# Altium schematic sheet Э3_2.SchDoc: =title_line_1 + title_line_2
size 594 x 420 mm; SheetNumber: 2; SheetTotal: 2
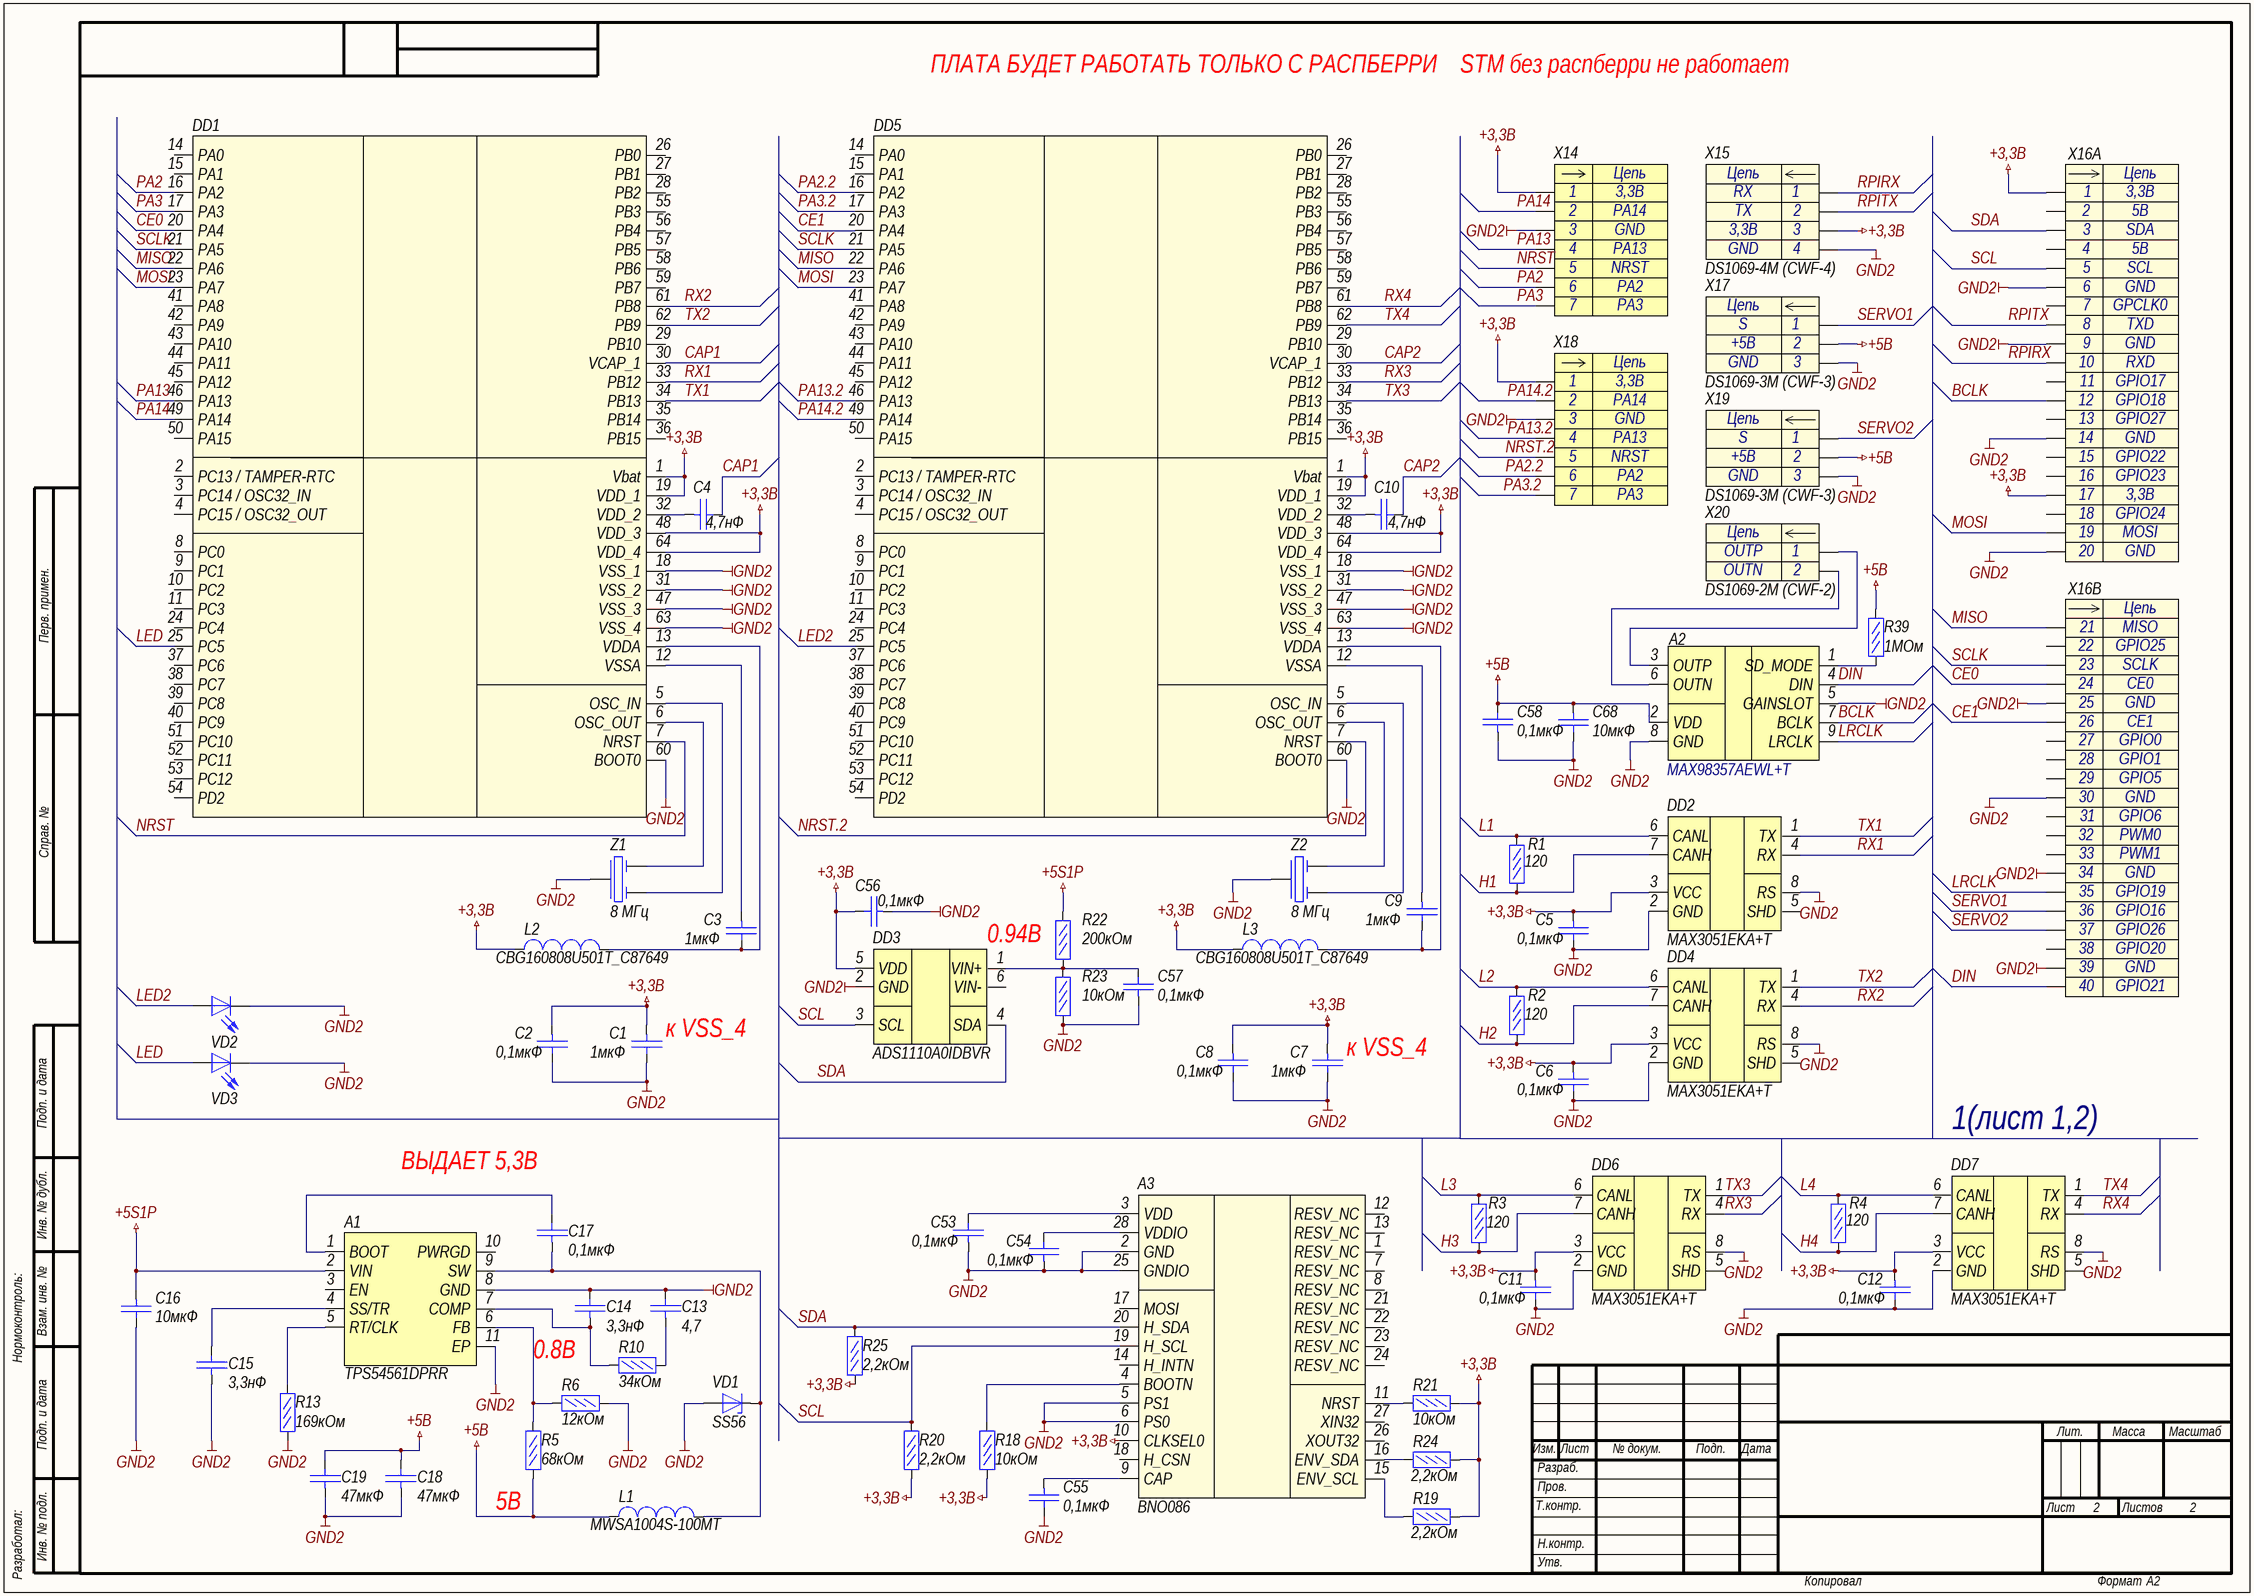
[diagram p0: Э3_2.SchDoc]

## Parts
A1  TPS54561DPRR
A2  MAX98357AEWL+T  [SO-8]
A3  BNO086  [TQFP44]
C1  1мкФ  [C0603]
C2  0,1мкФ  [C0603]
C3  1мкФ  [C0603]
C4  4,7нФ  [C0603]
C5  0,1мкФ  [C0603]
C6  0,1мкФ  [C0603]
C7  1мкФ  [C0603]
C8  0,1мкФ  [C0603]
C9  1мкФ  [C0603]
C10  4,7нФ  [C0603]
C11  0,1мкФ  [C0603]
C12  0,1мкФ  [C0603]
C13  4,7  [C0603]
C14  3,3нФ  [C0603]
C15  3,3нФ  [C0603]
C16  10мкФ  [C0603]
C17  0,1мкФ  [C0603]
C18  47мкФ  [C0603]
C19  47мкФ  [C0603]
C53  0,1мкФ  [C0603]
C54  0,1мкФ  [C0603]
C55  0,1мкФ  [C0603]
C56  0,1мкФ  [C0603]
C57  0,1мкФ  [C0603]
C58  0,1мкФ  [C0603]
C68  10мкФ  [C0603]
DD1  STM32F446RET6  [LQFP48]  (value not drawn)
DD2  MAX3051EKA+T  [SO-8]
DD3  ADS1110A0IDBVR  [SO-8]
DD4  MAX3051EKA+T  [SO-8]
DD5  STM32F446RET6  [LQFP48]  (value not drawn)
DD6  MAX3051EKA+T  [SO-8]
DD7  MAX3051EKA+T  [SO-8]
L1  MWSA1004S-100MT  [L0603]
L2  CBG160808U501T_C87649  [INDUCTION-12.2x12.2]
L3  CBG160808U501T_C87649  [INDUCTION-12.2x12.2]
R1  120  [R0603]
R2  120  [R0603]
R3  120  [R0603]
R4  120  [R0603]
R5  68кОм  [R0603]
R6  12кОм  [R0603]
R10  34кОм  [R0603]
R13  169кОм  [R0603]
R18  10кОм  [R0603]
R19  2,2кОм  [R0603]
R20  2,2кОм  [R0603]
R21  10кОм  [R0603]
R22  200кОм  [R0603]
R23  10кОм  [R0603]
R24  2,2кОм  [R0603]
R25  2,2кОм  [R0603]
R39  1МОм  [R0603]
VD1  SS56
VD2  (no value)  [LED_0603]
VD3  (no value)  [LED_0603]
X14  (no value)  [pls-2,54-7-tht-v]
X15  DS1069-4M (CWF-4)  [CWF-4]
X16  PLS-6 (DS1021-1x6)  [PLS-6]  (value not drawn)  (parts A,B of 2)
X17  DS1069-3M (CWF-3)  [CWF-2]
X18  (no value)  [pls-2,54-7-tht-v]
X19  DS1069-3M (CWF-3)  [CWF-2]
X20  DS1069-2M (CWF-2)  [CWF-2]
Z1  8 MГц  [QSMD3.2x2.5]
Z2  8 MГц  [QSMD3.2x2.5]

## Nets
+3,3В: A3.10(CLKSEL0) C1.2 C2.2 C5.2 C6.2 C7.2 C8.2 C11.2 C12.2 C56.1 DD1.1(Vbat) DD1.19(VDD_1) DD1.48(VDD_3) DD1.64(VDD_4) DD2.3(VCC) DD3.5(VDD) DD4.3(VCC) DD5.1(Vbat) DD5.19(VDD_1) DD5.48(VDD_3) DD5.64(VDD_4) DD6.3(VCC) DD7.3(VCC) L2.1 L3.1 R18.1 R19.1 R20.2 R21.2 R24.2 R25.2 X14.1 X15.3 X16.1 X16.17 X18.1
+5S1P: A1.2(VIN) C16.2 R22.2
+5В: A2.2(VDD) C18.1 C19.1 C58.1 C68.2 L1.1 R5.2 R39.1 X17.2 X19.2
GND2: A1.8(GND) A1.11(EP) A2.5(GAINSLOT) A2.8(GND) A3.2(GND) A3.5(PS1) A3.6(PS0) A3.25(GNDIO) C1.1 C2.1 C5.1 C6.1 C7.1 C8.1 C11.1 C12.1 C13.1 C14.1 C15.2 C16.1 C18.2 C19.2 C53.2 C54.2 C55.1 C56.2 C57.2 C58.2 C68.1 DD1.18(VSS_1) DD1.31(VSS_2) DD1.47(VSS_3) DD1.60(BOOT0) DD1.63(VSS_4) DD2.2(GND) DD2.8(RS) DD3.2(GND) DD4.2(GND) DD4.8(RS) DD5.18(VSS_1) DD5.31(VSS_2) DD5.47(VSS_3) DD5.60(BOOT0) DD5.63(VSS_4) DD6.2(GND) DD6.8(RS) DD7.2(GND) DD7.8(RS) R6.2 R13.2 R23.1 VD1.2(A) VD2.1(K) VD3.1(K) X14.3 X15.4 X16.6 X16.9 X16.14 X16.20 X16.25 X16.30 X16.34 X16.39 X17.3 X18.3 X19.3 Z1.2 Z2.2
BCLK: A2.7(BCLK) X16.12
CAP1: C4.1 DD1.30(VCAP_1)
CAP2: C10.1 DD5.30(VCAP_1)
CE0: DD1.20(PA4) X16.24
CE1: DD5.20(PA4) X16.26
DIN: A2.4(DIN) X16.40
H1: DD2.7(CANH) R1.1
H2: DD4.7(CANH) R2.1
H3: DD6.7(CANH) R3.1
H4: DD7.7(CANH) R4.1
L1: DD2.6(CANL) R1.2
L2: DD4.6(CANL) R2.2
L3: DD6.6(CANL) R3.2
L4: DD7.6(CANL) R4.2
LED: DD1.25(PC5) VD3.2(A)
LED2: DD5.25(PC5) VD2.2(A)
LRCLK: A2.9(LRCLK) X16.35
MISO: DD1.22(PA6) DD5.22(PA6) X16.21
MOSI: DD1.23(PA7) DD5.23(PA7) X16.19
NRST: DD1.7(NRST) X14.5
NRST.2: DD5.7(NRST) X18.5
PA2: DD1.16(PA2) X14.6
PA2.2: DD5.16(PA2) X18.6
PA3: DD1.17(PA3) X14.7
PA3.2: DD5.17(PA3) X18.7
PA13: DD1.46(PA13) X14.4
PA13.2: DD5.46(PA13) X18.4
PA14: DD1.49(PA14) X14.2
PA14.2: DD5.49(PA14) X18.2
RPIRX: X15.1 X16.10
RPITX: X15.2 X16.8
RX1: DD1.33(PB12) DD2.4(RX)
RX2: DD1.61(PB8) DD4.4(RX)
RX3: DD5.33(PB12) DD6.4(RX)
RX4: DD5.61(PB8) DD7.4(RX)
SCL: A3.19(H_SCL) DD3.3(SCL) R20.1 X16.5
SCLK: DD1.21(PA5) DD5.21(PA5) X16.23
SDA: A3.20(H_SDA) DD3.4(SDA) R25.1 X16.3
SERVO1: X16.36 X17.1
SERVO2: X16.37 X19.1
TX1: DD1.34(PB13) DD2.1(TX)
TX2: DD1.62(PB9) DD4.1(TX)
TX3: DD5.34(PB13) DD6.1(TX)
TX4: DD5.62(PB9) DD7.1(TX)
NetA1_1: A1.1(BOOT) C17.1
NetA1_4: A1.4(SS/TR) C15.1
NetA1_5: A1.5(RT/CLK) R13.1
NetA1_6: A1.6(FB) R5.1 R6.1
NetA1_7: A1.7(COMP) C14.2 R10.1
NetA1_9: A1.9(SW) C17.2 L1.2 VD1.1(K)
NetA2_1: A2.1(SD_MODE) R39.2
NetA2_3: A2.3(OUTP) X20.1
NetA2_6: A2.6(OUTN) X20.2
NetA3_3: A3.3(VDD) C53.1
NetA3_4: A3.4(BOOTN) R18.2
NetA3_9: A3.9(CAP) C55.2
NetA3_11: A3.11(NRST) R21.1
NetA3_15: A3.15(ENV_SCL) R19.2
NetA3_16: A3.16(ENV_SDA) R24.1
NetA3_28: A3.28(VDDIO) C54.1
NetC3_1: C3.1 DD1.13(VDDA) L2.2
NetC3_2: C3.2 DD1.12(VSSA)
NetC4_2: C4.2 DD1.32(VDD_2)
NetC9_1: C9.1 DD5.13(VDDA) L3.2
NetC9_2: C9.2 DD5.12(VSSA)
NetC10_2: C10.2 DD5.32(VDD_2)
NetC13_2: C13.2 R10.2
NetC57_1: C57.1 DD3.1(VIN+) R22.1 R23.2
NetDD1_5: DD1.5(OSC_IN) Z1.3
NetDD1_6: DD1.6(OSC_OUT) Z1.1
NetDD5_5: DD5.5(OSC_IN) Z2.3
NetDD5_6: DD5.6(OSC_OUT) Z2.1

Not connected (* = marked no-connect by the designer): A1 3(EN) 10(PWRGD); A3 1(RESV_NC) 7(RESV_NC) 8(RESV_NC) 12(RESV_NC) 13(RESV_NC) 14(H_INTN) 17(MOSI) 18(H_CSN) 21(RESV_NC) 22(RESV_NC) 23(RESV_NC) 24(RESV_NC) 26(XOUT32) 27(XIN32); DD1 2(PC13_/_TAMPER-RTC) 3(PC14_/_OSC32_IN) 4(PC15_/_OSC32_OUT) 8(PC0) 9(PC1) 10(PC2) 11(PC3) 14(PA0) 15(PA1) 24(PC4) 26(PB0) 27(PB1) 28(PB2) 29(PB10) 35(PB14) 36(PB15) 37(PC6) 38(PC7) 39(PC8) 40(PC9) 41(PA8) 42(PA9) 43(PA10) 44(PA11) 45(PA12) 50(PA15) 51(PC10) 52(PC11) 53(PC12) 54(PD2) 55(PB3) 56(PB4) 57(PB5) 58(PB6) 59(PB7); DD2 5(SHD); DD3 6(VIN-); DD4 5(SHD); DD5 2(PC13_/_TAMPER-RTC) 3(PC14_/_OSC32_IN) 4(PC15_/_OSC32_OUT) 8(PC0) 9(PC1) 10(PC2) 11(PC3) 14(PA0) 15(PA1) 24(PC4) 26(PB0) 27(PB1) 28(PB2) 29(PB10) 35(PB14) 36(PB15) 37(PC6) 38(PC7) 39(PC8) 40(PC9) 41(PA8) 42(PA9) 43(PA10) 44(PA11) 45(PA12) 50(PA15) 51(PC10) 52(PC11) 53(PC12) 54(PD2) 55(PB3) 56(PB4) 57(PB5) 58(PB6) 59(PB7); DD6 5(SHD); DD7 5(SHD); X16 2 4 7 11(1) 13(3) 15(5) 16(6) 18(4) 22(2) 27 28(4) 29(5) 31(1) 32(2) 33(3) 38(4)

## Notes on the sheet
- ПЛАТА БУДЕТ РАБОТАТЬ ТОЛЬКО С РАСПБЕРРИ
- STM без распберри не работает
- 0.94В
- (near C1) к VSS_4
- (near C7) к VSS_4
- ВЫДАЕТ 5,3В
- 1(лист 1,2)
- (near C14) 0.8В
- (near R5) 5В
- Перв. примен.
- Справ. №
- Подп. и дата
- Инв. № дубл.
- Нормоконтроль:
- Взам. инв. №
- Изм.
- Лист
- № докум.
- Подп.
- Дата
- Лит.
- Масса
- Масштаб
- Т.контр.
- Пров.
- Разраб.
- Листов
- Разработал:
- Инв. № подл.
- Н.контр.
- Утв.
- Копировал
- Формат
- А2
- (in symbol CWF-2) Цепь
- (in symbol CWF-3) Цепь
- (in symbol CWF-4) Цепь
- (in symbol PLS-7) Цепь
- (in symbol PLS-20, part A) Цепь
- (in symbol PLS-20, part B) Цепь

## Library data of the parts
A1 = TPS54561DPRR: DC/DC преобразователь
A2 = MAX98357AEWL+T: Manufacturer: International Rectifier; Name: MAX98357AEWL+T
A3 = BNO086: Микроконтроллер AVR 8-bit; Name: BNO086; HelpURL: https://files.amperka.ru/datasheets/ATMega32u4.pdf
C1-C19 C53-C58 C68 = C0603: Конденсатор керамический 0603; Name: -; Manufacturer: -; TKE: -; Voltage: -
  C1 C3 C7 C9: Value: 1мкФ
  C2 C5 C6 C8 C11 C12 C17 C53-C58: Value: 0,1мкФ
  C4 C10: Value: 4,7нФ
  C13: Value: 4,7
  C14 C15: Value: 3,3нФ
  C16 C68: Value: 10мкФ
  C18 C19: Value: 47мкФ
DD1 DD5 = STM32F446RET6: Микроконтроллер; Name: STM32F446RET6
DD2 DD4 DD6 DD7 = MAX3051EKA+T: Приемопередатчик RS-485 полудуплекс 10(мБит); Manufacturer: Analog Devices; Name: MAX3051EKA+T
DD3 = ADS1110A0IDBVR: аналого-цифровой преобразователь; Manufacturer: Analog Devices; Name: ADS1110A0IDBVR
L1 = BLM18PG181: Ферритовая бусина; Manufacturer: Murata; Name: MWSA1004S-100MT
L2 = Noname индуктивность: Ферритовая бусина; Name: CBG160808U501T_C87649; Value: -; I saturation: -
L3 = Noname индуктивность: Катушка; Name: CBG160808U501T_C87649; Value: -; I saturation: -
R1-R6 R10 R13 R18-R25 R39 = RC0603FR-071ML: Резистор1МОм 0,1Вт 1%; Manufacturer: YAGEO; Name: RC0603FR-071ML; Tolerance: 1%
  R1-R4: Value: 120
  R5: Value: 68кОм
  R6: Value: 12кОм
  R10: Value: 34кОм
  R13: Value: 169кОм
  R18 R21 R23: Value: 10кОм
  R19 R20 R24 R25: Value: 2,2кОм
  R22: Value: 200кОм
  R39: Value: 1МОм
VD1 = SMAJ12A: Диод защитный 12В; Name: SS56
VD2 VD3 = LED: Светодиод
X14 X18 = PLS-7: Contact_1: 3,3B; Contact_2: PA14; Contact_3: GND; Contact_4: PA13; Contact_5: NRST; Contact_6: PA2; Contact_7: PA3; ClassName: *
X15 = CWF-4: Разъем - 4 конт. прямая вилка на плату; Contact_1: RX; Contact_2: TX; Contact_3: 3,3B; Contact_4: GND; Name: DS1069-4M (CWF-4)
X16 = PLS-20: Разъем - 20 конт. прямая вилка на плату, шаг 2,54 мм; Contact_1: 3,3B; Contact_2: 5B; Contact_3: SDA; Contact_5: SCL; Contact_6: GND; Contact_7: GPCLK0; Contact_8: TXD; Contact_10: RXD; Contact_11: GPIO17; Contact_12: GPIO18; Contact_13: GPIO27; Contact_15: GPIO22; Contact_16: GPIO23; Contact_18: GPIO24; Contact_19: MOSI; Contact_4: 5B; Name: PLS-6 (DS1021-1x6); Contact_9: GND; Contact_14: GND; Contact_17: 3,3B; Contact_20: GND
X17 X19 = CWF-3: Разъем - 3 конт. прямая вилка на плату; Contact_1: S; Contact_2: +5B; Contact_3: GND; Name: DS1069-3M (CWF-3)
X20 = CWF-2: Разъем - 2 конт. прямая вилка на плату; Contact_1: OUTP; Contact_2: OUTN; Name: DS1069-2M (CWF-2)
Z1 Z2 = CSTNE8M00G55A000R0: керамический резонатор 16МГц; Partnumber: 12.88605; Name: CSTNE8M00G55A000R0; Value: 8 MГц